# EAGLE design motor interfacing (EAGLE 9.3.0)

## Sheet 1 of 3: Shield Connectors
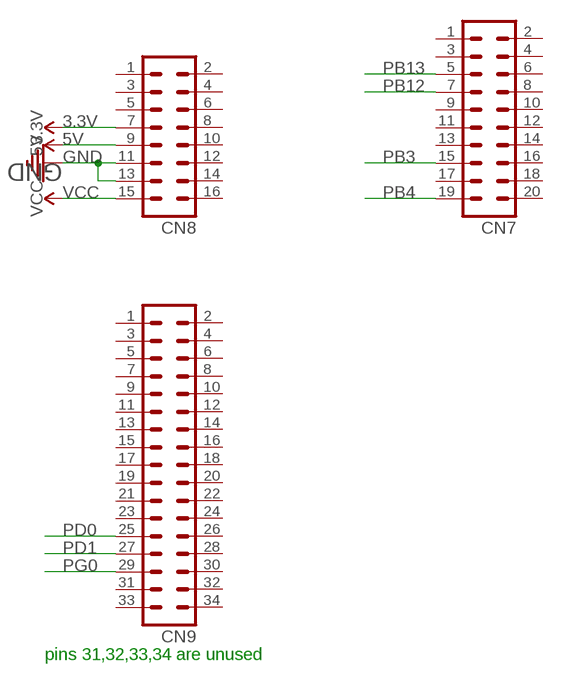
[diagram p0: schematic, sheet 1]

### Parts
CN7  MA10-2  [MA10-2]
CN8  MA08-2  [MA08-2]
CN9  MA17-2  [MA17-2]
GND1  GND  (no package)

### Nets
3.3V: CN8.7
5V: CN8.9 ; also sheet 2
GND: CN8.11 CN8.13 GND1.GND ; also sheet 2,3
PB3: CN7.15 ; also sheet 2
PB4: CN7.19 ; also sheet 2
PB12: CN7.7 ; also sheet 2
PB13: CN7.5 ; also sheet 2
PD0: CN9.25 ; also sheet 2
PD1: CN9.27 ; also sheet 2
PG0: CN9.29 ; also sheet 3
VCC: CN8.15 ; also sheet 3
Unconnected: CN7.1 CN7.2 CN7.3 CN7.4 CN7.6 CN7.8 CN7.9 CN7.10 CN7.11 CN7.12 CN7.13 CN7.14 CN7.16 CN7.17 CN7.18 CN7.20 CN8.1 CN8.2 CN8.3 CN8.4 CN8.5 CN8.6 CN8.8 CN8.10 CN8.12 CN8.14 CN8.16 CN9.1 CN9.2 CN9.3 CN9.4 CN9.5 CN9.6 CN9.7 CN9.8 CN9.9 CN9.10 CN9.11 CN9.12 CN9.13 CN9.14 CN9.15 CN9.16 CN9.17 CN9.18 CN9.19 CN9.20 CN9.21 CN9.22 CN9.23 CN9.24 CN9.26 CN9.28 CN9.30 CN9.31 CN9.32 CN9.33 CN9.34

### Notes on the sheet
- pins 31,32,33,34 are unused

## Sheet 2 of 3: CAN
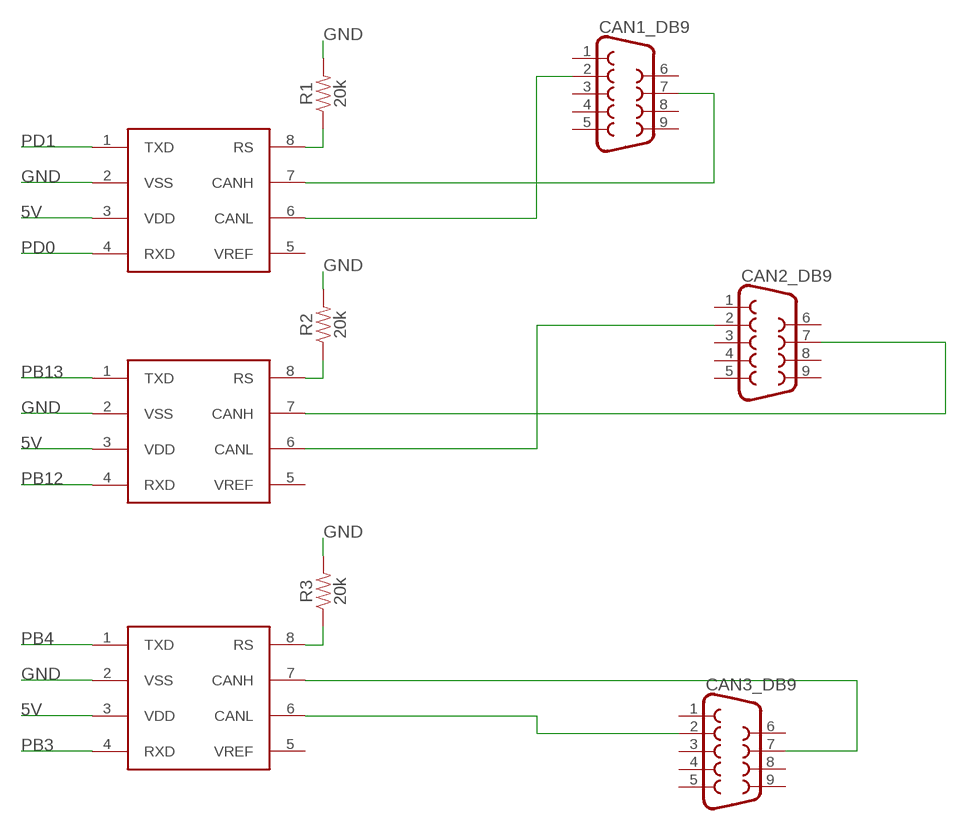
[diagram p1: schematic, sheet 2]

### Parts
CAN1  MCP2551  [MPC2551]
CAN1_DB9  DB9FEMALE  [DB9]
CAN2  MCP2551  [MPC2551]
CAN2_DB9  DB9FEMALE  [DB9]
CAN3  MCP2551  [MPC2551]
CAN3_DB9  DB9FEMALE  [DB9]
R1  20k  1KOHM-HORIZ-1/4W-5%  [AXIAL-0.3]
R2  20k  1KOHM-HORIZ-1/4W-5%  [AXIAL-0.3]
R3  20k  1KOHM-HORIZ-1/4W-5%  [AXIAL-0.3]

### Nets
5V: CAN1.3(VDD) CAN2.3(VDD) CAN3.3(VDD) ; also sheet 1
GND: CAN1.2(VSS) CAN2.2(VSS) CAN3.2(VSS) R1.P$2 R2.P$2 R3.P$2 ; also sheet 1,3
N$1: CAN1.7(CANH) CAN1_DB9.7
N$2: CAN1.6(CANL) CAN1_DB9.2
N$3: CAN2.6(CANL) CAN2_DB9.2
N$4: CAN3.6(CANL) CAN3_DB9.2
N$5: CAN3.7(CANH) CAN3_DB9.7
N$7: CAN1.8(RS) R1.P$1
N$8: CAN2.8(RS) R2.P$1
N$9: CAN3.8(RS) R3.P$1
N$11: CAN2.7(CANH) CAN2_DB9.7
PB3: CAN3.4(RXD) ; also sheet 1
PB4: CAN3.1(TXD) ; also sheet 1
PB12: CAN2.4(RXD) ; also sheet 1
PB13: CAN2.1(TXD) ; also sheet 1
PD0: CAN1.4(RXD) ; also sheet 1
PD1: CAN1.1(TXD) ; also sheet 1
Unconnected: CAN1.5(VREF) CAN1_DB9.1 CAN1_DB9.3 CAN1_DB9.4 CAN1_DB9.5 CAN1_DB9.6 CAN1_DB9.8 CAN1_DB9.9 CAN2.5(VREF) CAN2_DB9.1 CAN2_DB9.3 CAN2_DB9.4 CAN2_DB9.5 CAN2_DB9.6 CAN2_DB9.8 CAN2_DB9.9 CAN3.5(VREF) CAN3_DB9.1 CAN3_DB9.3 CAN3_DB9.4 CAN3_DB9.5 CAN3_DB9.6 CAN3_DB9.8 CAN3_DB9.9

## Sheet 3 of 3: Power and Pyro
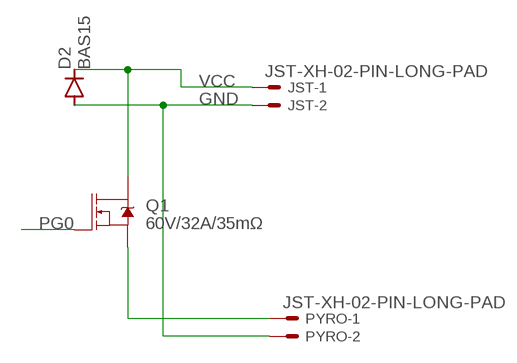
[diagram p2: schematic, sheet 3]

### Parts
D2  BAS15  [DO34-7]
JST  JST-XH-02-PIN-LONG-PAD  [JST-XH-02-PACKAGE-LONG-PAD]
PYRO  JST-XH-02-PIN-LONG-PAD  [JST-XH-02-PACKAGE-LONG-PAD]
Q1  60V/32A/35mΩ  MOSFET-NCH-FQP30N06L  [TO220V]

### Nets
GND: D2.A JST.2 PYRO.2 ; also sheet 1,2
N$10: PYRO.1 Q1.3(S)
PG0: Q1.1(G) ; also sheet 1
VCC: D2.C JST.1 Q1.2(D) ; also sheet 1

## Library data of the parts
CAN1-CAN3 = elm:MCP2551
CAN1_DB9 CAN2_DB9 CAN3_DB9 = SparkFun-Connectors:DB9: DB9 Connector Standard DB9 (D-Sub 9) serial connector. Can be used for CAN bus as well as RS485 and RS232. Footprint production proven. Here is the female version connector we sell at SparkFun: 9 Pin Female Serial Connector - PCB Mount <https://www.sparkfun.com/products/429> (PRT-00429) This connector has been used on the following SparkFun products: SparkFun RS232 Shifter - SMD <https://www.sparkfun.com/products/449> (PRT-00449) SparkFun RS232 Shifter SMD (No DB9) <https://www.sparkfun.com/products/8780> (PRT-08780); PROD_ID: CONN-08194
CN7 = con-lstb:MA10-2: PIN HEADER; OC_FARNELL: unknown; OC_NEWARK: unknown
CN8 = con-lstb:MA08-2: PIN HEADER; OC_FARNELL: unknown; OC_NEWARK: unknown
CN9 = con-lstb:MA17-2: PIN HEADER; OC_FARNELL: unknown; OC_NEWARK: unknown
D2 = diode:BAS15: DIODE high speed
GND1 = Connectors:GND
JST PYRO = Rembrandt Electronics - JST XH Connectors v1-0:JST-XH-02-PIN: JST XH Connector 2 Pin Wire to board connector. Pitch: 2,54 mm, (0.100") Number of pins: 2 Created by Rembrandt Electronics www.rembrandtelectronics.com
Q1 = SparkFun-DiscreteSemi:MOSFET-NCH: N-channel MOSFETs Voltage controlled devices that allow control of high current outputs. SparkFun Products: SparkFun OpenScale <https://www.sparkfun.com/products/13261> SparkFun Digital Sandbox <https://www.sparkfun.com/products/12651> SparkFun Monster Moto Shield <https://www.sparkfun.com/products/10182> SparkFun MOSFET Power Controller <https://www.sparkfun.com/products/11214>; PROD_ID: TRANS-10060
R1-R3 = SparkFun-Resistors:1KOHM: 1kΩ resistor A resistor is a passive two-terminal electrical component that implements electrical resistance as a circuit element. Resistors act to reduce current flow, and, at the same time, act to lower voltage levels within circuits. - Wikipedia; PROD_ID: RES-08380; VALUE: 1k

## Board
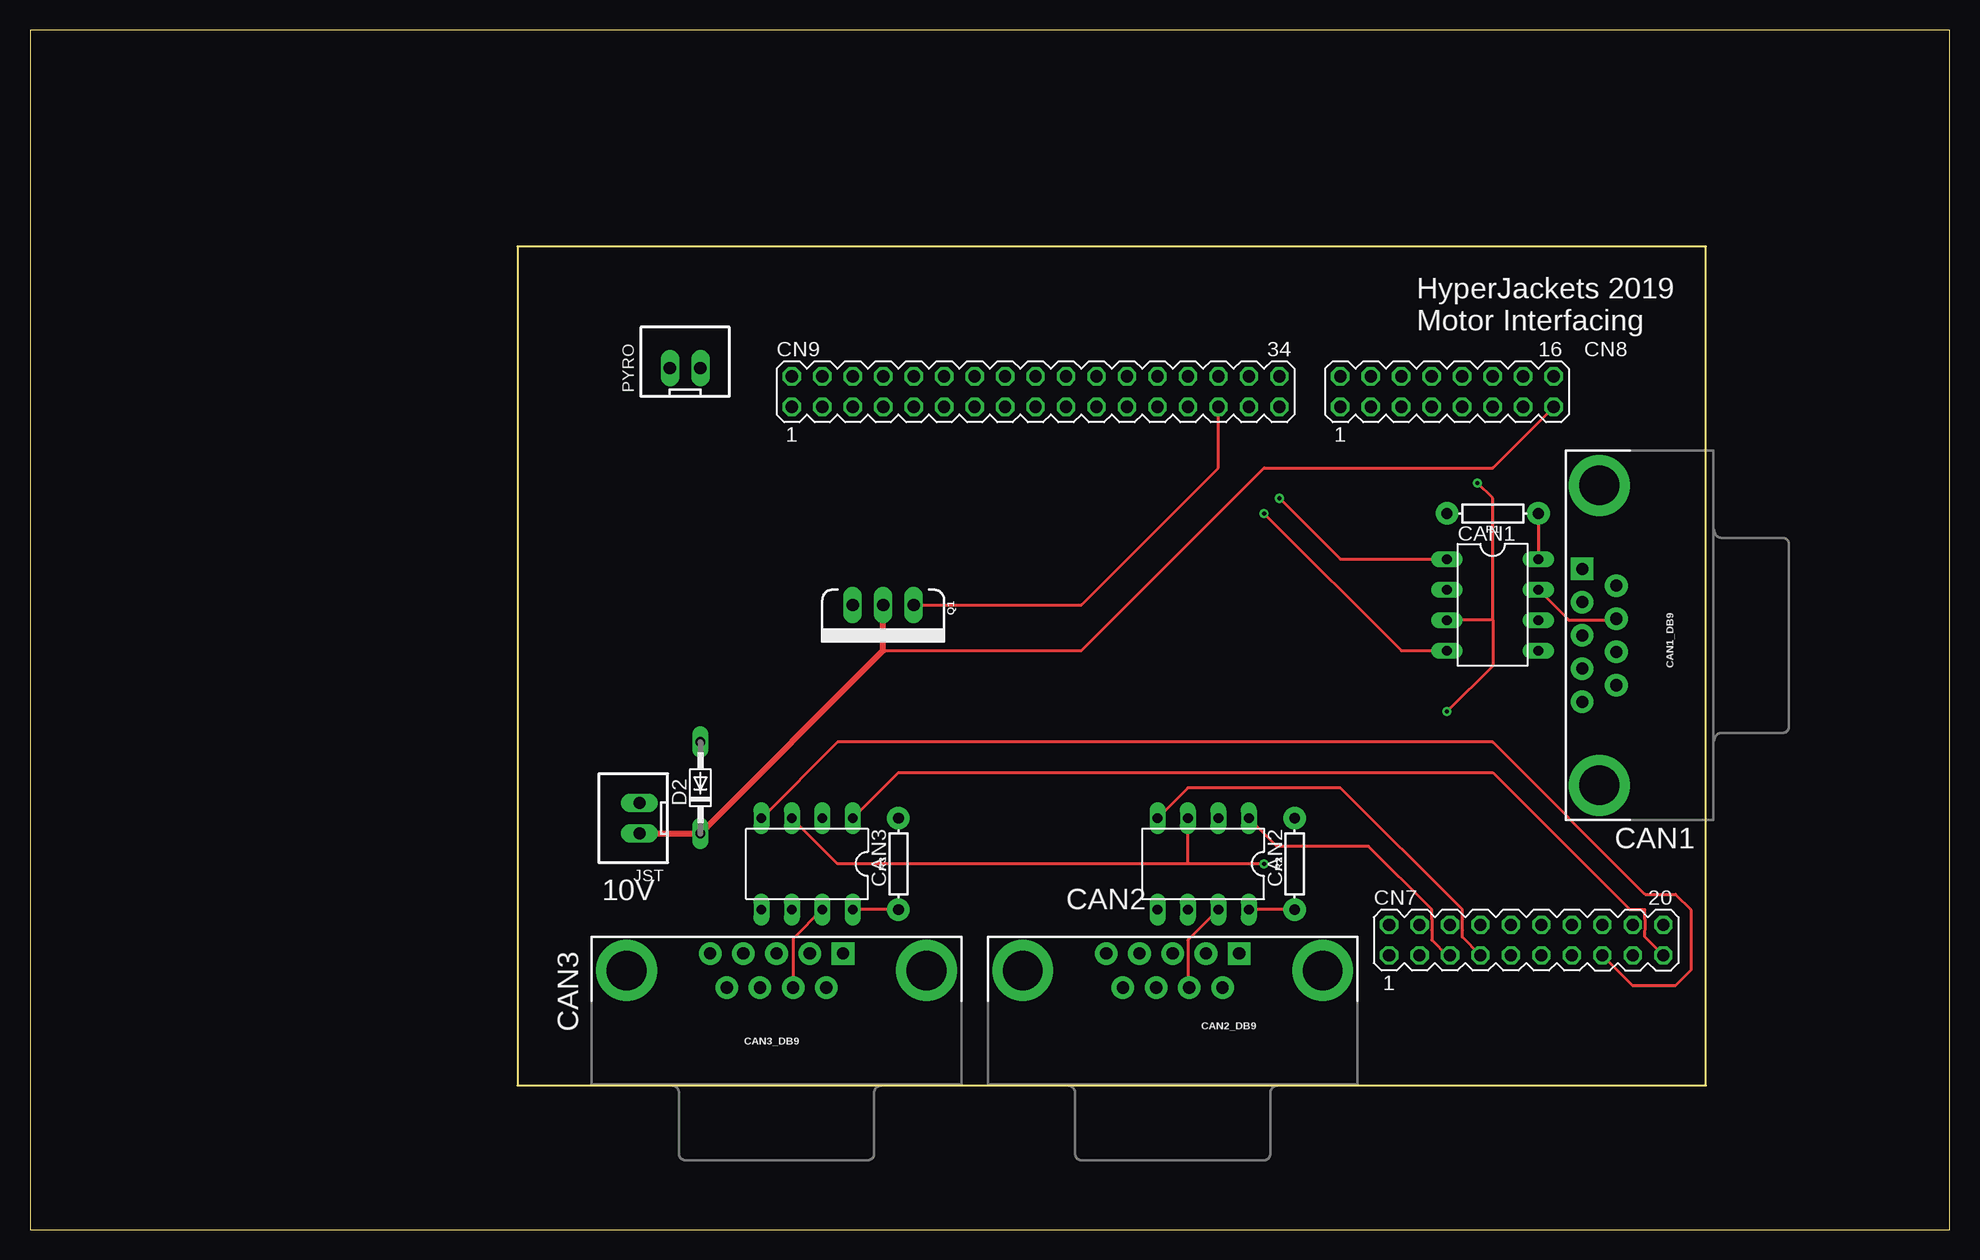
[diagram p3: board, top side]
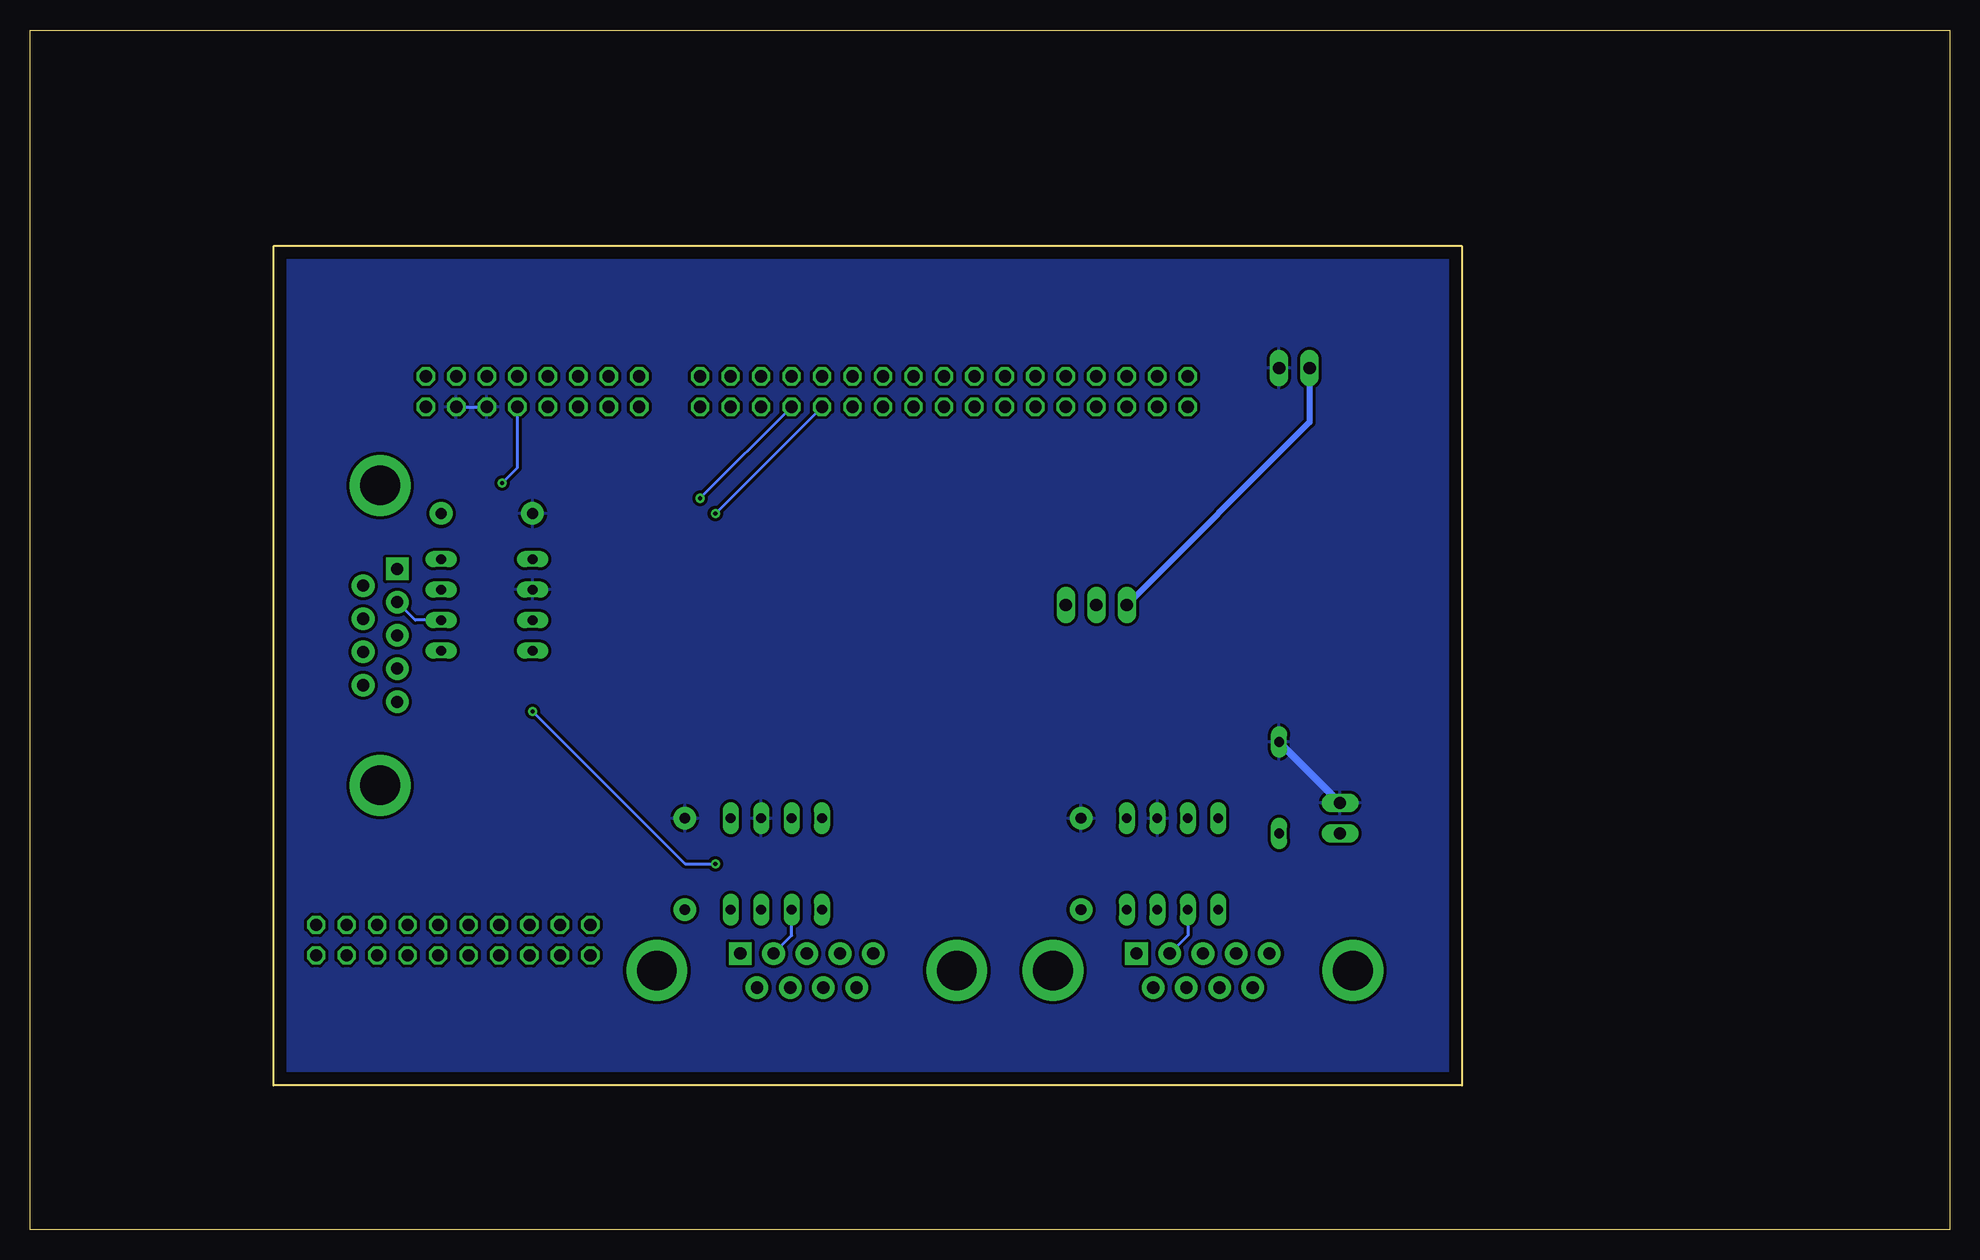
[diagram p4: board, bottom side, seen from below]

Size 160 x 100 mm. Coordinates in mm from the lower left corner, seen from the top.
Outline: 0,0 160,0 160,100 0,100 0,0
Outline: 40.64,81.98 40.64,12 139.7,12 139.7,81.98 40.64,81.98
Copper layers (1*16): Top 0.035mm / dielectric 1.5mm / Bottom 0.035mm
Design rules "default": minimum track width 6mil, minimum drill 0.35mm, track to track 6mil, track to pad 6mil, pad to pad 6mil, via to via 6mil, smd to smd 6mil, copper to edge 40mil, drill to drill 6mil, minimum pad ring 10mil, minimum via ring 8mil, stop-mask expansion 4mil, vias tented up to drill 0mil, thermal gap 10mil

### Footprints (pad centres in the part's own frame; a part is rotated, then mirrored left to right if it is on the bottom)
MPC2551 = drill 0.813 long: 1 -2.54,1.27; 2 0,1.27; 3 2.54,1.27; 4 5.08,1.27; 5 5.08,8.89; 6 2.54,8.89; 7 0,8.89; 8 -2.54,8.89
DB9 = drill 1.016 pad 1.88 square: 1 -5.54,-1.42 | drill 1.016 pad 1.88: 2 -2.77,-1.42; 3 0,-1.42; 4 2.77,-1.42; 5 5.54,-1.42; 6 -4.15,1.42; 7 -1.38,1.42; 8 1.38,1.42; 9 4.15,1.42 | drill 3.302 pad 5.08: G1 -12.5,0; G2 12.5,0
MA10-2 = drill 1.016 octagon: 1 -11.43,-1.27; 2 -11.43,1.27; 3 -8.89,-1.27; 4 -8.89,1.27; 5 -6.35,-1.27; 6 -6.35,1.27; 7 -3.81,-1.27; 8 -3.81,1.27; 9 -1.27,-1.27; 10 -1.27,1.27; 11 1.27,-1.27; 12 1.27,1.27; 13 3.81,-1.27; 14 3.81,1.27; 15 6.35,-1.27; 16 6.35,1.27; 17 8.89,-1.27; 18 8.89,1.27; 19 11.43,-1.27; 20 11.43,1.27
MA08-2 = drill 1.016 octagon: 1 -8.89,-1.27; 2 -8.89,1.27; 3 -6.35,-1.27; 4 -6.35,1.27; 5 -3.81,-1.27; 6 -3.81,1.27; 7 -1.27,-1.27; 8 -1.27,1.27; 9 1.27,-1.27; 10 1.27,1.27; 11 3.81,-1.27; 12 3.81,1.27; 13 6.35,-1.27; 14 6.35,1.27; 15 8.89,-1.27; 16 8.89,1.27
MA17-2 = drill 1.016 octagon: 1 -20.32,-1.27; 2 -20.32,1.27; 3 -17.78,-1.27; 4 -17.78,1.27; 5 -15.24,-1.27; 6 -15.24,1.27; 7 -12.7,-1.27; 8 -12.7,1.27; 9 -10.16,-1.27; 10 -10.16,1.27; 11 -7.62,-1.27; 12 -7.62,1.27; 13 -5.08,-1.27; 14 -5.08,1.27; 15 -2.54,-1.27; 16 -2.54,1.27; 17 0,-1.27; 18 0,1.27; 19 2.54,-1.27; 20 2.54,1.27; 21 5.08,-1.27; 22 5.08,1.27; 23 7.62,-1.27; 24 7.62,1.27; 25 10.16,-1.27; 26 10.16,1.27; 27 12.7,-1.27; 28 12.7,1.27; 29 15.24,-1.27; 30 15.24,1.27; 31 17.78,-1.27; 32 17.78,1.27; 33 20.32,-1.27; 34 20.32,1.27
DO34-7 = drill 0.813 long: A 3.81,0; C -3.81,0
JST-XH-02-PACKAGE-LONG-PAD = drill 1.016 long: 1 -1.27,0; 2 1.27,0
TO220V = drill 1.016 long: 1 -2.54,0; 2 0,0; 3 2.54,0
AXIAL-0.3 = drill 0.9 pad 1.88: P$1 -3.81,0; P$2 3.81,0

### Placement (x,y rotation side)
CAN1  116.84,53.34 270 top
CAN1_DB9  130.81,49.53 270 top
CAN2  99.06,35.56 180 top
CAN2_DB9  95.25,21.59 180 top
CAN3  66.04,35.56 180 top
CAN3_DB9  62.23,21.59 180 top
CN7  124.71,24.13 0 top
CN8  118.11,69.85 0 top
CN9  83.82,69.85 0 top
D2  55.88,36.83 90 top
JST  50.8,34.29 90 top
PYRO  54.61,71.82 0 top
Q1  71.12,52.07 180 top
R1  121.92,59.69 180 top
R2  105.41,30.48 90 top
R3  72.39,30.48 90 top

### Tracks (layer width: path | path; a pad name or v marks a point on that pad's centre or on a via)
5V  (via drill 0.35)
  Top 0.254: v120.65,62.23 121.92,60.96 121.92,50.8 | 121.92,50.8 121.92,46.99 v118.11,43.18 | 121.92,50.8 CAN1.3 | v102.87,30.48 96.52,30.48 | 96.52,30.48 CAN2.3 | 96.52,30.48 67.31,30.48 CAN3.3
  Bottom 0.254: CN8.9 119.38,63.5 v120.65,62.23 | v118.11,43.18 105.41,30.48 v102.87,30.48
GND
  Bottom 0.254: CN8.13 CN8.11
  Bottom 0.61: D2.A JST.2
  pour Bottom (isolate 0.254): 33.02,83.82 146.05,85.09 149.86,6.35 29.21,7.62
N$1
  Top 0.254: CAN1.7 128.27,50.8 132.12,50.8 CAN1_DB9.7
N$2
  Bottom 0.254: CAN1.6 127.89,50.8 CAN1_DB9.2
N$3
  Bottom 0.254: CAN2_DB9.2 96.52,24.51 CAN2.6
N$4
  Bottom 0.254: CAN3.6 63.5,24.51 CAN3_DB9.2
N$5
  Top 0.254: CAN3.7 63.61,24.24 CAN3_DB9.7
N$7
  Top 0.254: R1.P$1 CAN1.8
N$8
  Top 0.254: R2.P$1 CAN2.8
N$9
  Top 0.254: R3.P$1 CAN3.8
N$10
  Bottom 0.508: Q1.3 53.34,67.31 53.34,71.12
  Bottom 0.61: PYRO.1 53.34,71.12
N$11
  Top 0.254: CAN2.7 96.52,24.13 96.52,20.28 CAN2_DB9.7
PB3
  Top 0.254: CN7.15 133.6,20.32 137.16,20.32 138.43,21.59 138.43,26.67 137.16,27.94 134.62,27.94 121.92,40.64 67.31,40.64 CAN3.4
PB4
  Top 0.254: CAN3.1 72.39,38.1 121.92,38.1 133.35,26.67 134.62,26.67 134.62,25.86 134.65,25.83 134.65,24.97 134.62,24.94 134.62,24.38 CN7.19
PB12
  Top 0.254: CAN2.4 96.52,36.83 109.22,36.83 119.38,26.67 119.38,25.86 119.41,25.83 119.41,24.97 119.38,24.94 119.38,24.38 CN7.7
PB13
  Top 0.254: CAN2.1 103.95,31.94 111.57,31.94 116.84,26.67 116.84,25.86 116.86,25.83 116.86,24.97 116.84,24.94 116.84,24.13 118.11,22.86 CN7.5
PD0  (via drill 0.35)
  Top 0.254: v102.87,59.69 114.3,48.26 CAN1.4
  Bottom 0.254: CN9.25 v102.87,59.69
PD1  (via drill 0.35)
  Top 0.254: v104.14,60.96 109.22,55.88 CAN1.1
  Bottom 0.254: CN9.27 v104.14,60.96
PG0
  Top 0.254: Q1.1 87.63,52.07 99.06,63.5 CN9.29
VCC
  Top 0.254: 71.12,48.26 87.63,48.26 102.87,63.5 121.92,63.5 CN8.15
  Top 0.508: Q1.2 71.12,48.26 D2.C JST.1

### Text on the board
tPlace: HyperJackets 2019 / Motor Interfacing | CAN1 | 10V | CAN2 | CAN3